# EAGLE design og14u (EAGLE 7.7.0)
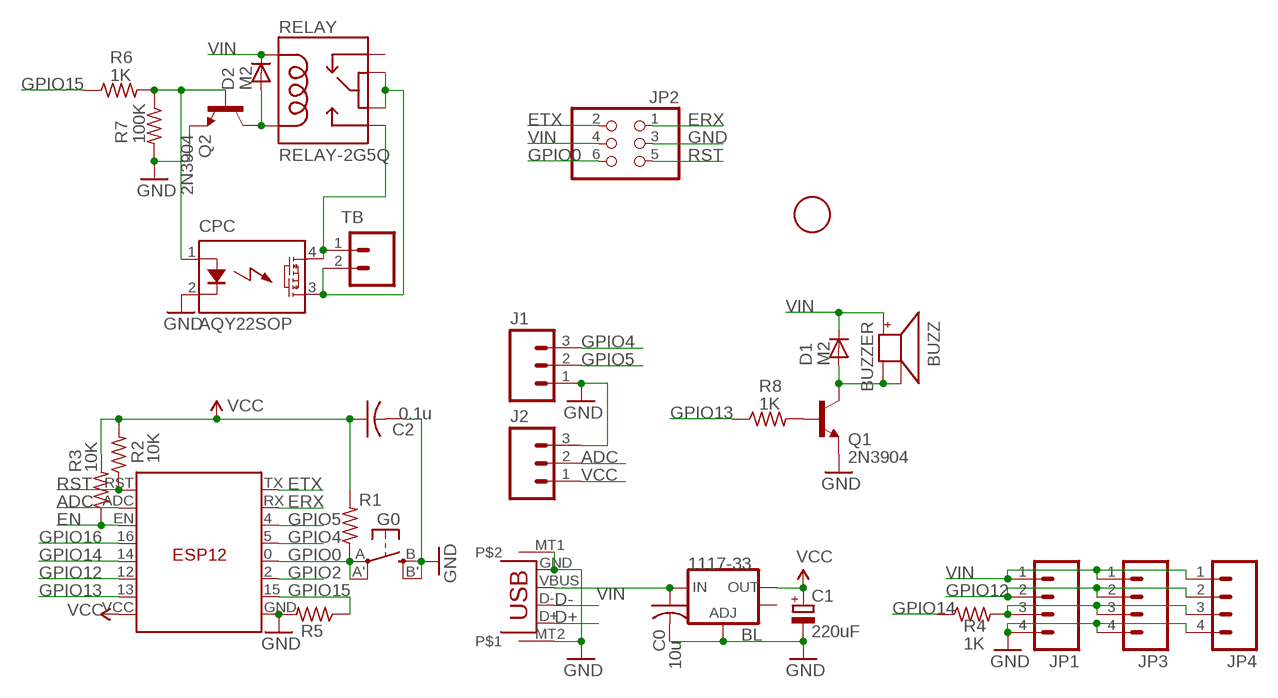
[diagram p0: schematic, sheet 1]

## Parts
1F  FIDUCIAL  [FIDUCIAL_1MM]
BL  1117-33  V_REG_LM1117SOT223  [SOT223]
BUZZ  BUZZER  [SMT-8585-BUZZER]
C0  10u  C-USC0805K  [C0805K]
C1  220uF  CPOL-EUB/3528-21R  [B/3528-21R]
C2  0.1u  C-USC0603K  [C0603K]
CPC  AQY22SOP  [SOP04]
D1  M2  DIODE-DO-214AC  [DO-214AC]
D2  M2  DIODE-DO-214AC  [DO-214AC]
ESP  ESP12  [ESP12]
G0  SPST_TACT-EVQQ2  [EVQ-Q2]
J1  M03PTH  [1X03]
J2  M03PTH  [1X03]
JP1  M04SONICSMD  [1X04_SONICSENSOR_SMD]
JP2  PINHD-2X3  [2X03]
JP3  M04DIST  [1X04_NO_SILK_DIST]
JP4  M04DIST  [1X04_NO_SILK_DIST]
Q1  2N3904  TRANSISTOR_NPNSOT23-3  [SOT23-3]
Q2  2N3904  TRANSISTOR_NPNSOT23-3  [SOT23-3]
R1  10K  R-US_R0603  [R0603]
R2  10K  R-US_R0603  [R0603]
R3  10K  R-US_R0603  [R0603]
R4  1K  R-US_R0603  [R0603]
R5  10K  R-US_R0603  [R0603]
R6  1K  R-US_R0603  [R0603]
R7  100K  R-US_R0603  [R0603]
R8  1K  R-US_R0603  [R0603]
RELAY  RELAY-2G5Q  [RELAY-G5V]
TB  OPENER  M02KF  [SCREWTERMINAL-5MM-2-KF]
X3  USB+GND  [USB-MICROB2]

## Nets
ADC: ESP.ADC J2.2
D+: X3.D+
D-: X3.D-
EN [power]: ESP.EN R3.1
ERX: ESP.RX JP2.1
ETX: ESP.TX JP2.2
GND: BL.1(ADJ) C0.2 C1.- C2.2 CPC.2(K) ESP.GND G0.B'(S1) G0.B(S) J1.1 J2.3 JP1.4 JP2.3 JP3.4 JP4.4 Q1.2(E) Q2.2(E) R5.2 R7.2 X3.GND X3.MT1 X3.MT2
GPIO0 [power]: ESP.0(G0) G0.A'(P1) G0.A(P) JP2.6 R1.1
GPIO2: ESP.2(G2)
GPIO4: ESP.5(G5) J1.3
GPIO5: ESP.4(G4) J1.2
GPIO12: ESP.12(G12) JP1.2 JP3.2 JP4.2
GPIO13: ESP.13(G13) R8.1
GPIO14: ESP.14(G14) R4.1
GPIO15: ESP.15(G15) R5.1 R6.1
GPIO16: ESP.16(G16)
N$1 [relaypower]: CPC.4(DS1) RELAY.10 TB.1
N$2 [relaypower]: CPC.3(DS2) RELAY.5 RELAY.6 TB.2
N$5: JP1.3 JP3.3 JP4.3 R4.2
N$6 [power]: BUZZ.- BUZZ.A- D1.A Q1.3(C)
N$8: Q1.1(B) R8.2
N$12: D2.A Q2.3(C) RELAY.9
N$14: CPC.1(A) Q2.1(B) R6.2 R7.1
RST [power]: ESP.RST JP2.5 R2.1
VCC [power]: BL.2(OUT) C1.+ C2.1 ESP.VCC J2.1 R1.2 R2.2 R3.2
VIN [power]: BL.3(IN) BUZZ.+ C0.1 D1.C D2.C JP1.1 JP2.4 JP3.1 JP4.1 RELAY.2 X3.VBUS
Unconnected: BL.4(OUT) RELAY.1

## Library data of the parts
1F = adafruitGood:FIDUCIAL: For use by pick and place machines to calibrate the vision/machine, 1mm By microbuilder.eu
BL = SparkFun:V_REG_LM1117: Voltage Regulator LM1117 Standard adjustable voltage regulator but in SMD form. Spark Fun Electronics SKU : COM-00595
BUZZ = adafruit:BUZZER
C0 C2 = adafruit:C-US: CAPACITOR, American symbol
C1 = rcl:CPOL-EU: POLARIZED CAPACITOR, European symbol
CPC = relay:AQY*: PhotoMOS Relay NAiS Source: http://www.panasonic-electric-works.com/catalogues/downloads/photomos/ds_x615_en_aqz10_20.pdf; OC_FARNELL: unknown; OC_NEWARK: unknown
D1 D2 = diode:DIODE-: DIODE
ESP = JeeParts:ESP12
G0 = adafruit_3:SPST_TACT: SMT 6mm switch, EVQQ2 series http://www.ladyada.net/library/eagle
J1 J2 = SparkFunNew:M03: Header 3 Standard 3-pin 0.1" header. Use with straight break away headers (SKU : PRT-00116), right angle break away headers (PRT-00553), swiss pins (PRT-00743), machine pins (PRT-00117), and female headers (PRT-00115). Molex polarized connector foot print use with SKU : PRT-08232 with associated crimp pins and housings.
JP1 = SparkFun:M04: Header 4 Standard 4-pin 0.1" header. Use with straight break away headers (SKU : PRT-00116), right angle break away headers (PRT-00553), swiss pins (PRT-00743), machine pins (PRT-00117), and female headers (PRT-00115). Molex polarized connector foot print use with SKU : PRT-08231 with associated ...
JP2 = pinhead:PINHD-2X3: PIN HEADER
JP3 JP4 = SparkFunNew:M04: Header 4 Standard 4-pin 0.1" header. Use with straight break away headers (SKU : PRT-00116), right angle break away headers (PRT-00553), swiss pins (PRT-00743), machine pins (PRT-00117), and female headers (PRT-00115). Molex polarized connector foot print use with SKU : PRT-08231 with associated ...
Q1 Q2 = SparkFunNew:TRANSISTOR_NPN: Transistor NPN BJT configuration in SOT23 package. MMBT2222 is the common NPN we use. Double check BCE configuration again layout.
R1-R3 R5 = adafruit (picker 的冲突副本 2014-10-29):R-US_: RESISTOR, American symbol
R4 R6-R8 = adafruit2013:R-US_: RESISTOR, American symbol
RELAY = SparkFunNew:RELAY-2
TB = SparkFun:M02: Header 2 Standard 2-pin 0.1" header. Use with straight break away headers (SKU : PRT-00116), right angle break away headers (PRT-00553), swiss pins (PRT-00743), machine pins (PRT-00117), and female headers (PRT-00115). Molex polarized connector foot print use with SKU : PRT-08233 with associated crimp pins and housings.
X3 = SparkFunNew:USB+GND

## Net classes
0 default: width 0.178 mm, clearance 0.178 mm
1 power: width 0.254 mm, clearance 0.178 mm
2 relaypower: width 0.406 mm, clearance 0.305 mm

## Board
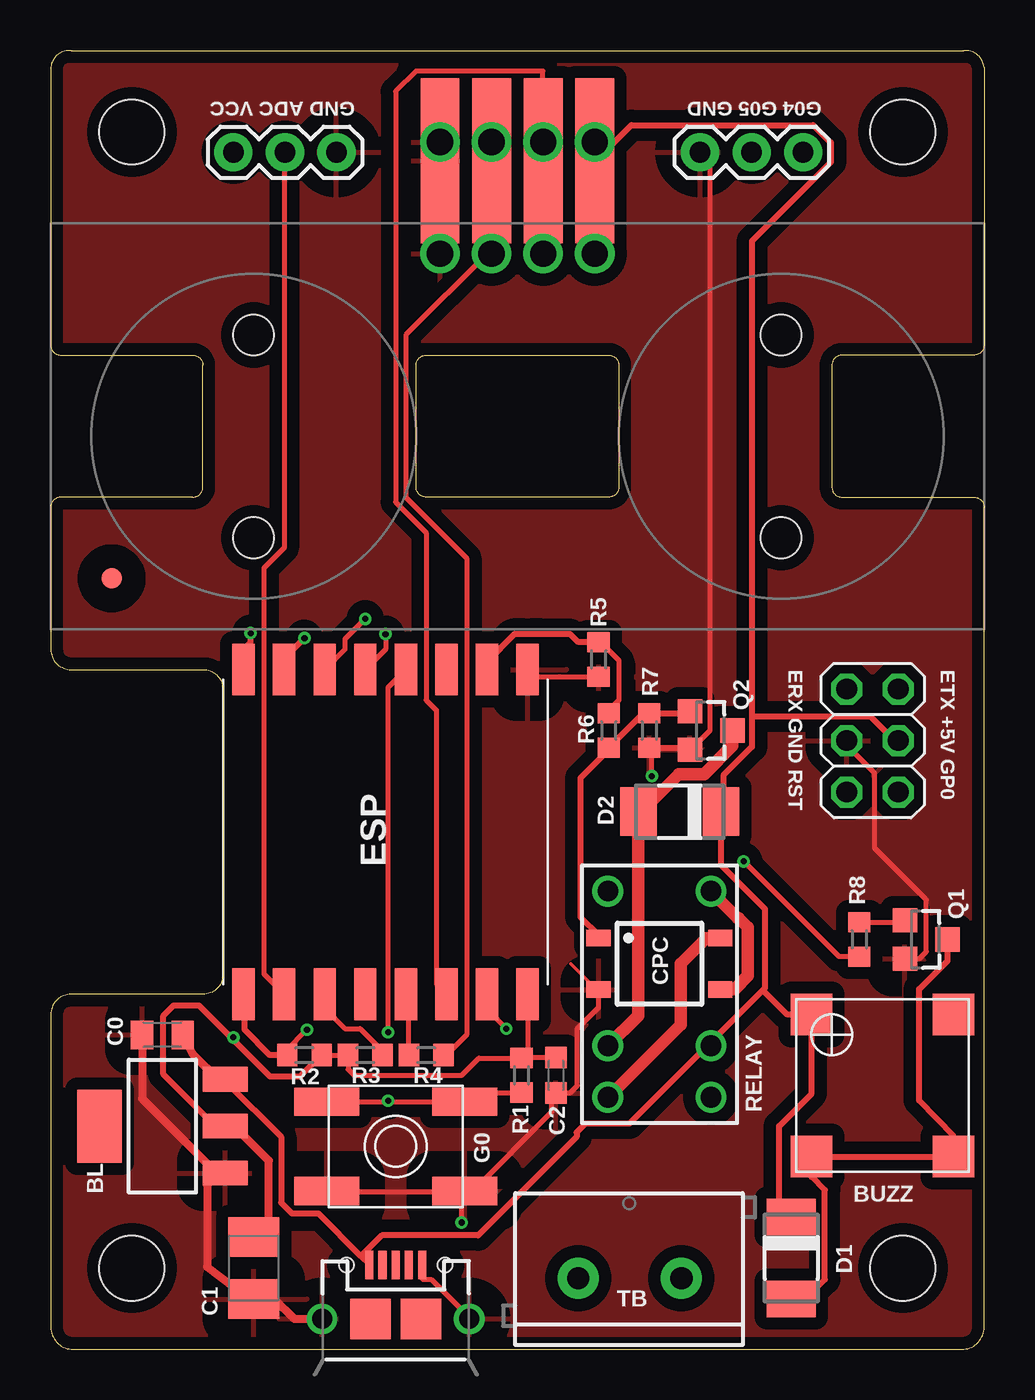
[diagram p1: board, top side]
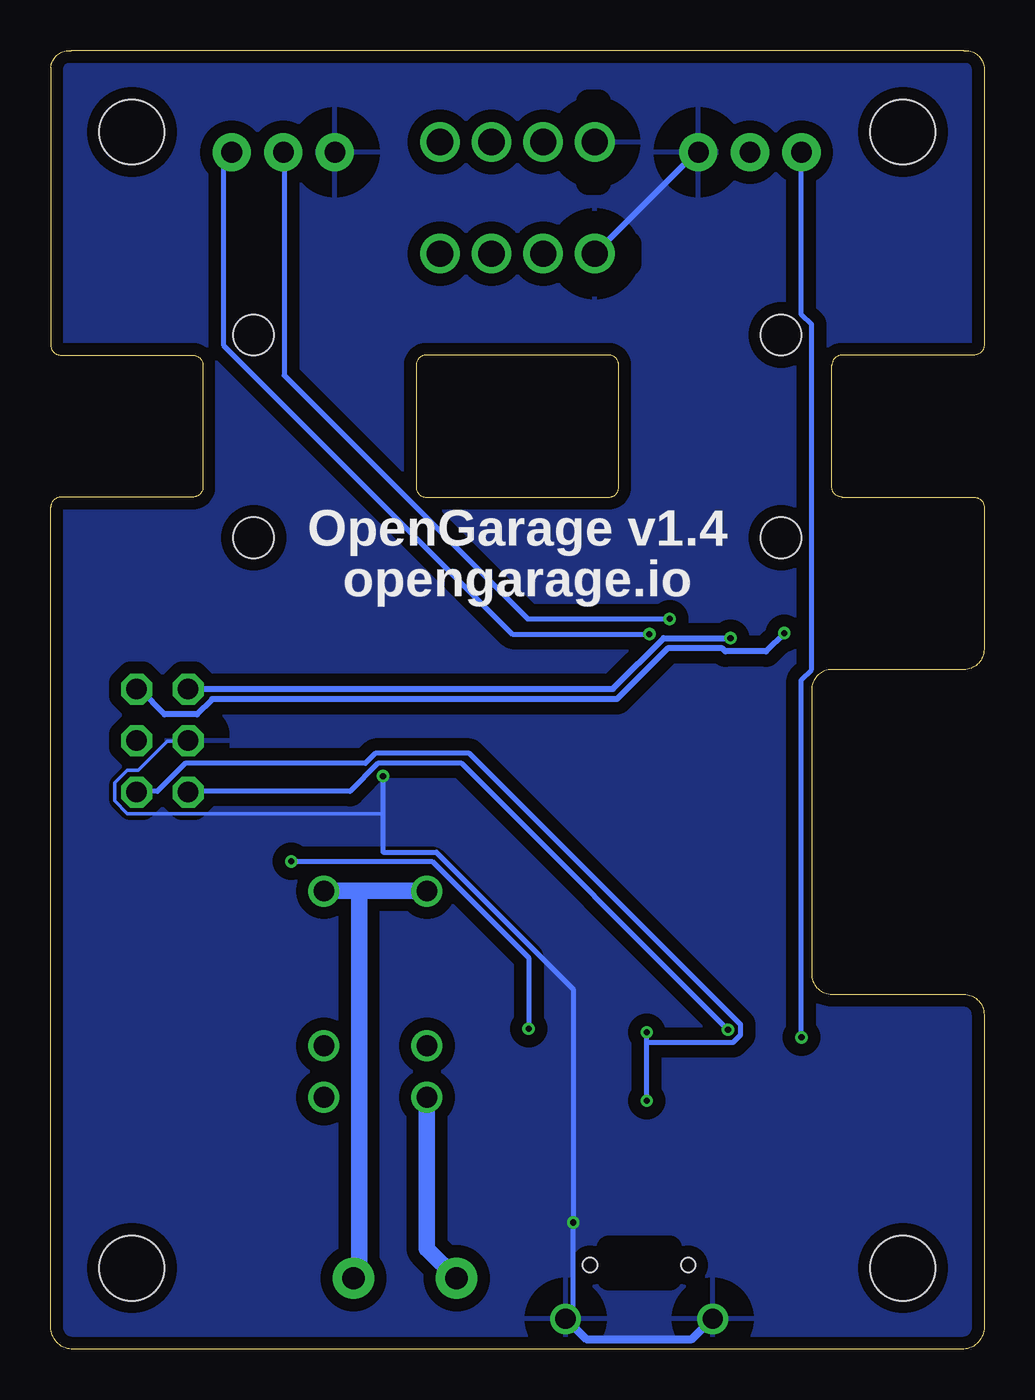
[diagram p2: board, bottom side, seen from below]

Size 46.01 x 64.01 mm. Coordinates in mm from the lower left corner, seen from the top.
Outline: 1,0 45,0 arc90 46,1.2 46,41.5 arc90 45.5,42 39,42 arc-90 38.5,42.5 38.5,48.5 arc-90 39,49 45.5,49 arc90 46,49.5 46,63.2 arc90 45,64 1,64 arc90 0,63.2 0,49.5 arc90 0.5,49 7,49 arc-90 7.5,48.5 7.5,42.5 arc-90 7,42 0.5,42 arc90 0,41.5 0,34.5 arc90 1,33.5 7.5,33.5 arc-90 8.5,32.5 8.5,18.5 arc-90 7.5,17.5 1,17.5 arc90 0,16.5 0,1.2 arc90 1,0
Outline: 18,42.5 18,48.5 arc-90 18.5,49 27.5,49 arc-90 28,48.5 28,42.5 arc-90 27.5,42 18.5,42 arc-90 18,42.5
Copper layers (1*16): Top 0.035mm / dielectric 1.5mm / Bottom 0.035mm
Design rules "Fusion_eagle_rule_v1.1 *": minimum track width 6mil, minimum drill 12mil, track to track 6mil, track to pad 6mil, pad to pad 6mil, via to via 6mil, smd to smd 0mil, copper to edge 10mil, drill to drill 10mil, minimum pad ring 10mil, minimum via ring 6mil, stop-mask expansion 2mil, vias tented up to drill 100mil, thermal gap 50mil
Holes 3.2 mm at 42,4 42,60 4,4 4,60
Holes 2 mm at 10,40 10,50 36,40 36,50
bRestrict: area 15.5,3.5 to 18.5,5; area 17.5,53.5 to 18,54.5; area 19,55 to 19.5,55.5; area 19,52.5 to 19.5,53; area 19,61 to 19.5,61.5; area 19,57.5 to 19.5,58
vRestrict: area 8,18.5 to 25,32.5

### Footprints (pad centres in the part's own frame; a part is rotated, then mirrored left to right if it is on the bottom)
FIDUCIAL_1MM = smd 1 x 1: 1 0,0
SOT223 = smd 1.219 x 2.235: 1 -2.311,-3.099; 2 0,-3.099; 3 2.311,-3.099 | smd 3.6 x 2.2: 4 0,3.099
SMT-8585-BUZZER = smd 2.05 x 2.05: + -3.5,-3.5; - 3.5,-3.5; A- 3.5,3.5; NC1 -3.5,3.5
C0805K = smd 1.1 x 1.4: 1 -1,0; 2 1,0
B/3528-21R = smd 1.95 x 2.5: + 1.525,0; - -1.525,0
C0603K = smd 1.05 x 1.08: 1 -0.875,0; 2 0.875,0
SOP04 = smd 0.8 x 1.2: 1 -1.27,-3; 2 1.27,-3; 3 1.27,3; 4 -1.27,3
DO-214AC = smd 1.8 x 2.4: A 2.025,0; C -2.025,0
ESP12 = smd 2.54 x 1.1: 0 8,-1; 2 8,-3; 4 8,3; 5 8,1; 12 -8,-3; 13 -8,-5; 14 -8,-1; 15 8,-5; 16 -8,1; ADC -8,5; EN -8,3; GND 8,-7; RST -8,7; RX 8,5; TX 8,7; VCC -8,-7
EVQ-Q2 = smd 3.2 x 1.4: A -3.4,-2.2; A' 3.4,-2.2; B -3.4,2.2; B' 3.4,2.2
1X03 = drill 1.016 pad 1.88: 1 0,0; 2 2.54,0; 3 5.08,0
1X04_SONICSENSOR_SMD = smd 1.905 x 8.128: 1 -3.81,-5.08; 2 -1.27,-5.08; 3 1.27,-5.08; 4 3.81,-5.08
2X03 = drill 1.016 octagon: 1 -2.54,-1.27; 2 -2.54,1.27; 3 0,-1.27; 4 0,1.27; 5 2.54,-1.27; 6 2.54,1.27
1X04_NO_SILK_DIST = drill 1.3 pad 1.88: 1 0,0; 2 2.54,0; 3 5.08,0; 4 7.62,0
SOT23-3 = smd 1.2 x 1.2: 1 -0.95,-1; 2 0.95,-1; 3 0,1.1
R0603 = smd 1 x 1.1: 1 -0.85,0; 2 0.85,0
RELAY-G5V = drill 1.016: 1 5.08,2.54; 2 2.54,2.54; 5 -5.08,2.54; 6 -5.08,-2.54; 9 2.54,-2.54; 10 5.08,-2.54
SCREWTERMINAL-5MM-2-KF = drill 1.1 pad 2.032: 1 0,0; 2 5.08,0
USB-MICROB2 = smd 0.4 x 1.4: D+ 0,2.65; D- -0.65,2.65; GND 1.3,2.65; ID 0.65,2.65; VBUS -1.3,2.65 | drill 1: MT1 -3.625,0; MT2 3.625,0 | smd 2 x 2: MT3 1.25,0; MT4 -1.25,0 | hole 0.7: -2.425,2.65; 2.425,2.65

### Placement (x,y rotation side)
1F  3,38 90 top
BL  5.5,11 90 top
BUZZ  41,13 270 top
C0  5.5,15.5 180 top
C1  10,4 90 top
C2  24.9,13.5 270 top
CPC  30,19 270 top
D1  36.5,4.5 270 top
D2  31,26.5 180 top
ESP  16.5,25.5 90 top
G0  17,10 180 top
J1  32,59 0 top
J2  9,59 0 top
JP1  23,53.5 180 top
JP2  40.5,30 270 top
JP3  26.81,54 180 top
JP4  26.81,59.5 180 top
Q1  43.1,20.2 270 top
Q2  32.5,30.5 270 top
R1  23.2,13.5 90 top
R2  12.5,14.5 0 top
R3  15.5,14.5 180 top
R4  18.5,14.5 0 top
R5  27,34 270 top
R6  27.5,30.5 270 top
R7  29.5,30.5 270 top
R8  39.85,20.2 90 top
RELAY  30,17.5 270 top
TB  26,3.5 0 top
X3  17,1.5 0 top

### Tracks (layer width: path | path; a pad name or v marks a point on that pad's centre or on a via)
ADC
  Top 0.254: ESP.ADC 10.5,18.5 10.5,38.5 11.5,39.5 11.5,59 J2.2
EN
  Top 0.254: R3.1 16.35,14.7 15.25,15.8 14.5,15.8 13.5,16.8 ESP.EN
ERX  (via drill 0.3)
  Top 0.305: ESP.RX 11.5,34.05 v12.5,35.05
  Bottom 0.305: v12.5,35.05 15.8,35.05 18.3,32.55 39.2,32.55 JP2.1
ETX  (via drill 0.3)
  Top 0.305: v9.85,35.3 9.85,34.85 9.5,34.5 ESP.TX
  Bottom 0.305: v9.85,35.3 10.75,34.4 12.75,34.4 12.9,34.55 15.6,34.55 18.1,32.05 38.05,32.05 38.8,31.3 40.4,31.3 41.6,32.5 41.75,32.5 JP2.2
GND  (via drill 0.3)
  Top 0.178: 25.63,19 26.88,17.75 CPC.2
  Top 0.254: X3.GND 18.3,3.5 18.35,3.45 18.75,3.45 20.6,1.6 20.6,1.5 X3.MT2 | G0.B' 13.75,7.75 20.25,7.75 G0.B | v20.25,6.25 20.25,7.62 G0.B | v29.63,28.25 29.63,29.5 R7.2 | Q2.2 31.55,29.55 32.5,30.5 32.5,58.5 J1.1 | CPC.2 27,16.85 25.95,15.8 25.95,13 25.6,12.65 25,12.65 C2.2 24.7,12.43 24.7,11.7 20.8,7.8 G0.B | R5.2 23.55,33.15 23.5,33.2 ESP.GND | Q1.2 42.8,19.25 43.15,19.6 43.15,22.15 40.6,24.7 40.6,28.4 39.25,29.75 39.25,30 JP2.3
  Top 0.305: JP1.4 JP3.4 | R7.2 31.4,29.65 Q2.2
  Top 0.406: C0.2 4.5,12.35 8.15,8.7 8.55,8.7 BL.1 8.1,8.5 7.7,8.1 7.7,4.05 9.75,2.5 10,2.5 C1.- 10.2,2.5 11,2.5 12,1.5 X3.MT1
  Bottom 0.178: 29.63,26.4 42.23,26.4 42.85,27.03 42.85,27.91 42.23,28.54 41.7,28.54 40.28,29.96 39.3,29.96 JP2.3
  Bottom 0.254: X3.MT2 20.25,1.38 v20.25,6.25 20.25,17.75 27,24.5 29.63,24.5 29.63,26.4 v29.63,28.25
  Bottom 0.305: J2.3 arc-45 14.27,58.92 JP3.4
  Bottom 0.406: X3.MT1 13.4,1.5 14.4,0.5 19.6,0.5 20.6,1.5 X3.MT2
  pour Top (isolate 0.61): 0,64 46,64 46,0 0,0
  pour Bottom (isolate 0.61): 0,64 46,64 46,0 0,0
GPIO0  (via drill 0.3)
  Top 0.254: G0.A' 16.63,12.2 | 16.63,12.2 G0.A 21.4,12.2 21.85,12.65 R1.1 | ESP.0 16.63,32.62 v16.63,15.62 | v16.63,12.25 16.63,12.2
  Bottom 0.254: v16.63,12.25 16.63,15.12 | 16.63,15.12 v16.63,15.62 | 16.63,15.12 12.38,15.12 12,15.5 12,16 25.38,29.38 30,29.38 30.5,28.88 39.38,28.88 40.75,27.5 41.75,27.5 JP2.6
GPIO4  (via drill 0.3)
  Top 0.254: ESP.5 16.5,34.5 v16.5,35.25
  Bottom 0.254: v16.5,35.25 23.25,35.25 37.5,49.5 37.5,58.75 37.25,59 J1.3
GPIO5  (via drill 0.3)
  Top 0.254: ESP.4 14.5,34.5 14.5,35 v15.5,36
  Bottom 0.254: v15.5,36 22.5,36 34.5,48 34.5,59 J1.2
GPIO12
  Top 0.178: JP4.2 24.27,59.47 JP1.2
  Top 0.254: ESP.12 19,18 19,31.5 18.5,32 18.5,40.25 17,41.75 17,62 18,63 24.25,63 24.25,58.75 JP1.2
  Top 0.305: JP1.2 JP3.2
GPIO13  (via drill 0.3)
  Top 0.254: 21.5,18.15 ESP.13 21.5,16.75 v22.45,15.8 | v34.15,24.05 38.85,19.35 R8.1
  Bottom 0.254: v22.45,15.8 22.45,19.3 27.2,24.05 v34.15,24.05
GPIO14
  Top 0.254: R4.1 17.65,17.35 ESP.14
GPIO15
  Top 0.254: R6.1 27.5,31.5 28,32 28,33.95 27,34.95 R5.1
  Top 0.305: ESP.15 21.5,33.9 22.85,35.25 25.6,35.25 26,34.85 R5.1
N$1
  Top 0.61: RELAY.10 27.5,12.45 31.05,16 31.05,19 32.3,20.25 33,20.25 CPC.4
  Bottom 0.813: RELAY.10 27.46,4.96 TB.1
N$2
  Top 0.61: RELAY.5 32.55,22.55 33.85,21.25 33.9,21.25 34.35,20.8 34.35,18.4 33.7,17.75 33,17.75 CPC.3
  Bottom 0.813: 30.8,22.6 27.5,22.6 RELAY.6 | 30.8,22.6 32.5,22.6 RELAY.5 | 30.8,22.6 30.8,3.78 TB.2
N$5
  Top 0.178: JP4.3 21.78,59.47 21.78,58.67 JP1.3
  Top 0.254: R4.2 19.5,14.5 20.5,15.5 20.5,39 17.5,42 17.5,50 21.5,54 JP3.3
  Top 0.305: JP1.3 JP3.3
N$6
  Top 0.305: Q1.3 44.2,19.15 42.8,17.75 42.8,12.25 44.5,10.5 BUZZ.A- BUZZ.- 37.5,8.5 38.15,7.85 38.15,3.45 37.2,2.5 36.5,2.5 D1.A
N$8
  Top 0.254: R8.2 42,21.05 Q1.1
N$12
  Top 0.61: RELAY.9 28.95,16.45 28.95,26.5 D2.A 29.25,26.65 30.95,28.35 32.2,28.35 33.6,29.75 Q2.3
N$14
  Top 0.305: Q2.1 31.4,31.35 R7.1 29.2,31.35 R6.2 27.45,29.5 26.1,28.15 26.1,21.3 27,20.4 CPC.1
RST  (via drill 0.3)
  Top 0.254: v12.63,15.75 11.63,14.75 11.63,14.62 R2.1
  Top 0.305: R2.1 10.8,14.5 9.55,15.75 9.55,17.45 ESP.RST
  Bottom 0.254: v12.63,15.75 25.75,28.88 29.88,28.88 31.25,27.5 39.13,27.5 JP2.5
VCC  (via drill 0.3)
  Top 0.254: R2.2 R3.2 14.65,13.8 14.95,13.5 20.25,13.5 21.1,14.35 R1.2 | C2.1 23.23,14.38 R1.2 | ESP.VCC 23.5,14.65 R1.2 | v9,15.38 8.94,15.31
  Top 0.305: 9.05,11 8.1,11 5.55,13.55 5.55,16.45 6.05,16.95 7.3,16.95 8.94,15.31 10.8,13.45 12.3,13.45 R2.2
  Top 0.406: BL.2 9.05,11 10.75,9.3 10.75,5.6 10.7,5.55 10,5.55 C1.+
  Bottom 0.254: J2.1 9,51 8.5,50.5 8.5,33.5 9,33 v9,15.38
VIN
  Top 0.254: JP4.1 26.85,59.47 27.21,59.12 JP1.1
  Top 0.305: JP3.1 JP1.1 26.9,58.62 28.62,60.34 37.58,60.34 38.45,59.48 38.45,58.51 34.56,54.62 34.56,31.2 | 15.29,4.59 13.19,6.69 11.89,6.69 11.35,7.23 11.35,10.47 8.65,13.17 BL.3 | 15.29,4.59 15.67,4.21 X3.VBUS | 15.29,4.59 16.32,5.61 21.07,5.61 25.93,10.47 25.93,10.69 26.36,11.12 28.52,11.12 32.4,15.01 RELAY.2 32.51,15.11 35.1,17.7 | 35.1,17.7 35.21,17.81 35.21,21.7 33.05,23.86 33.05,26.45 D2.C 33.16,26.56 33.16,28.28 34.56,29.69 34.56,31.2 | D1.C 36.5,6.5 36,6.5 35.9,6.6 35.9,11 37.5,12.6 BUZZ.+ 36.3,16.5 35.1,17.7 | JP2.4 41.6,30 40.4,31.2 34.56,31.2
  Top 0.406: C0.1 7,14.55 8.25,13.3 8.55,13.3 BL.3

### Text on the board
tNames: GND ADC VCC | G04 G05 GND | ERX GND RST | ETX +5V GP0 | BUZZ
bNames: OpenGarage v1.4 | opengarage.io
cache: 1.500000 2.700000 2.950000 12.500000 3.000000 1.200000 10.000000 4.200000 3.000000 2.000000 7.000000 0.100000 3.200000 2 2 2 2 104